# Altium schematic sheet 6-Wheel Sensors.SchDoc
size A4
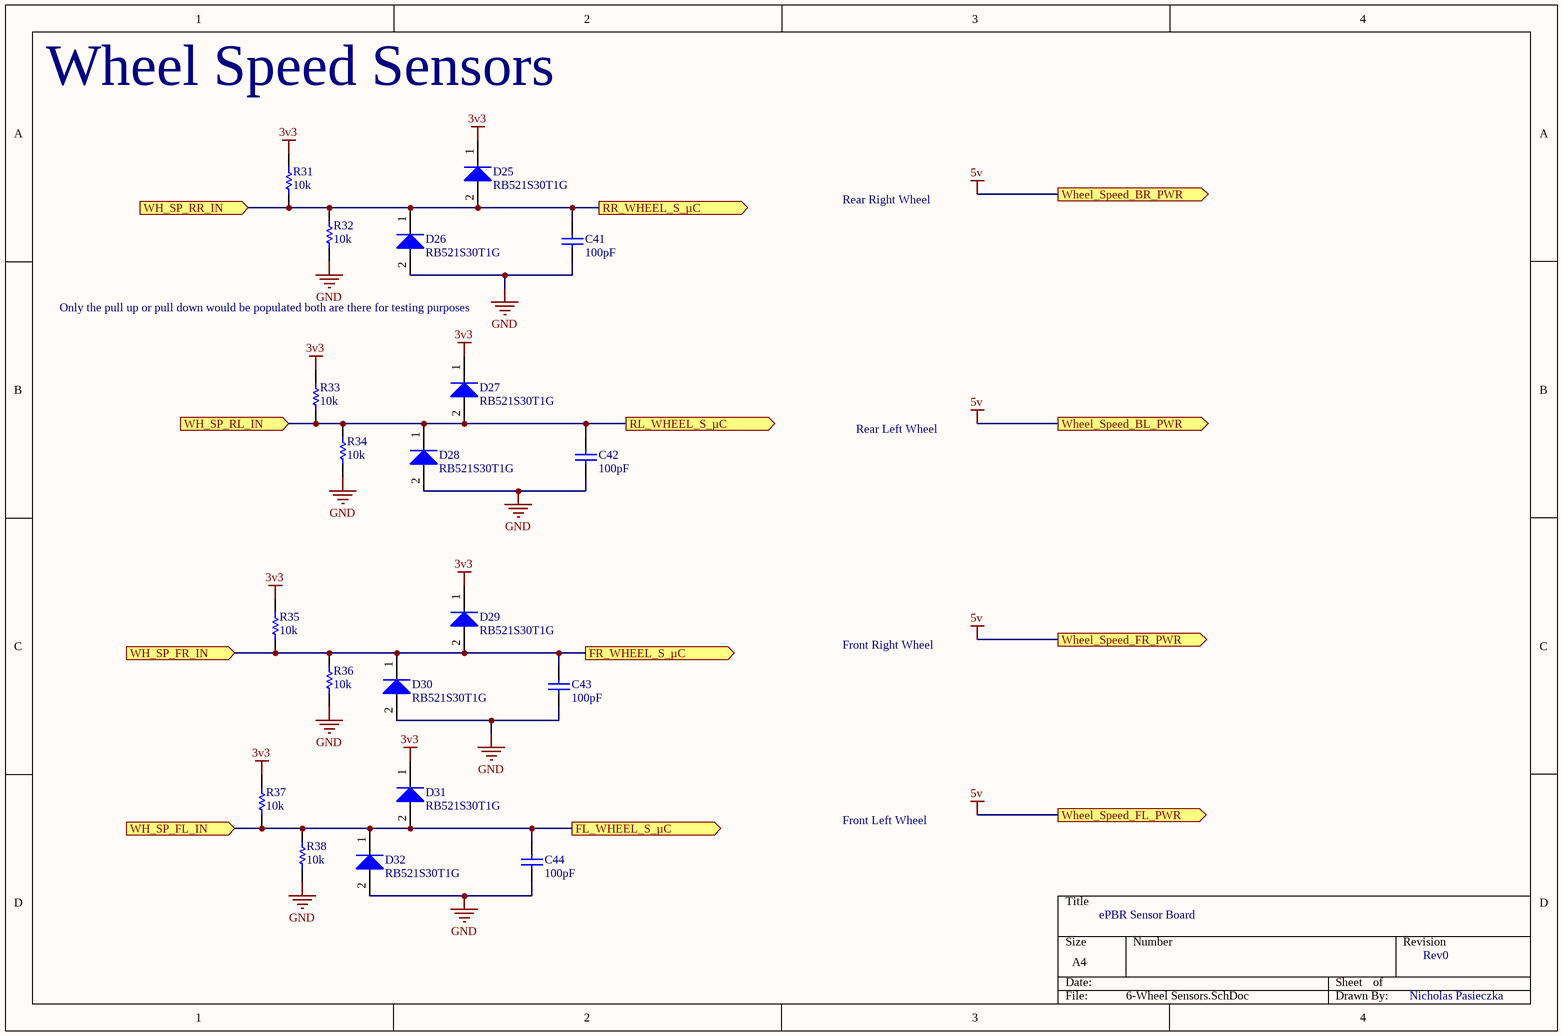
[diagram p0: 6-Wheel Sensors.SchDoc]

## Parts
C41  value 100pF  [1608[0603]]  (hidden comment: Cap)
C42  value 100pF  [1608[0603]]  (hidden comment: Cap)
C43  value 100pF  [1608[0603]]  (hidden comment: Cap)
C44  value 100pF  [1608[0603]]  (hidden comment: Cap)
D25  RB521S30T1G  [ONSC-SOD-523-2-502-01_V]
D26  RB521S30T1G  [ONSC-SOD-523-2-502-01_V]
D27  RB521S30T1G  [ONSC-SOD-523-2-502-01_V]
D28  RB521S30T1G  [ONSC-SOD-523-2-502-01_V]
D29  RB521S30T1G  [ONSC-SOD-523-2-502-01_V]
D30  RB521S30T1G  [ONSC-SOD-523-2-502-01_V]
D31  RB521S30T1G  [ONSC-SOD-523-2-502-01_V]
D32  RB521S30T1G  [ONSC-SOD-523-2-502-01_V]
R31  value 10k  [1608[0603]]  (hidden comment: Res1)
R32  value 10k  [1608[0603]]  (hidden comment: Res1)
R33  value 10k  [1608[0603]]  (hidden comment: Res1)
R34  value 10k  [1608[0603]]  (hidden comment: Res1)
R35  value 10k  [1608[0603]]  (hidden comment: Res1)
R36  value 10k  [1608[0603]]  (hidden comment: Res1)
R37  value 10k  [1608[0603]]  (hidden comment: Res1)
R38  value 10k  [1608[0603]]  (hidden comment: Res1)

## Ports
FL_WHEEL_S_µC (out), FR_WHEEL_S_µC (out), RL_WHEEL_S_µC (out), RR_WHEEL_S_µC (out), WH_SP_FL_IN (in), WH_SP_FR_IN (in), WH_SP_RL_IN (in), WH_SP_RR_IN (in), Wheel_Speed_BL_PWR (out), Wheel_Speed_BR_PWR (out), Wheel_Speed_FL_PWR (out), Wheel_Speed_FR_PWR (out)

## Nets
3v3: D25.1(K) D27.1(K) D29.1(K) D31.1(K) R31.2 R33.2 R35.2 R37.2
5v: port Wheel_Speed_BR_PWR, port Wheel_Speed_BL_PWR, port Wheel_Speed_FR_PWR, port Wheel_Speed_FL_PWR
GND: C41.1 C42.1 C43.1 C44.1 D26.2(A) D28.2(A) D30.2(A) D32.2(A) R32.1 R34.1 R36.1 R38.1
FL_WHEEL_S_µC: C44.2 D31.2(A) D32.1(K) R37.1 R38.2 ; port FL_WHEEL_S_µC, port WH_SP_FL_IN
FR_WHEEL_S_µC: C43.2 D29.2(A) D30.1(K) R35.1 R36.2 ; port FR_WHEEL_S_µC, port WH_SP_FR_IN
RL_WHEEL_S_µC: C42.2 D27.2(A) D28.1(K) R33.1 R34.2 ; port RL_WHEEL_S_µC, port WH_SP_RL_IN
RR_WHEEL_S_µC: C41.2 D25.2(A) D26.1(K) R31.1 R32.2 ; port RR_WHEEL_S_µC, port WH_SP_RR_IN

## Notes on the sheet
- Wheel Speed Sensors
- Rear Right Wheel
- Only the pull up or pull down would be populated both are there for testing purposes
- Rear Left Wheel
- Front Right Wheel
- Front Left Wheel
- ePBR Sensor Board
- Rev0
- Nicholas Pasieczka

## Library data of the parts
C41-C44 = Cap: Capacitor; Published: 8-Jun-2000; LatestRevisionDate: 17-Jul-2002; LatestRevisionNote: Re-released for DXP Platform.; PackageReference: RAD-0.3; Publisher: Altium Limited; PackageDescription: Radial Cap, Thru-Hole; 2 Leads; 0.3 in Pin Spacing
D25-D32 = CMP-1051-00018-1: Schottky Barrier Diode, 2-Pin SOD-523, Pb-Free, Tape and Reel; Manufacturer: On Semiconductor; Configuration: Single; IFSM Max (A): 1; Mounting Technology: Surface Mount; ComponentLink1Description: Manufacturer URL; PackageReference: SOD-523-2-502-01; RoHS: TRUE; ComponentLink3Description: Package Specification; ComponentLink2Description: Datasheet; PackageVersion: Rev. E, 09/2010; PartNumber: RB521S30T1G; ComponentLink3URL: http://www.onsemi.com/pub_link/Collateral/502-01.PDF; ComponentLink1URL: http://www.onsemi.com/; PackageDescription: 2-Pin SOD, Body 1.2 x 0.8 mm; DatasheetVersion: Rev. 8; ComponentLink2URL: http://www.onsemi.cn/pub_link/Collateral/RB521S30T1-D.PDF; Packing: Tape and Reel
R31-R38 = Res1: Resistor; Manufacturer: Yageo; Manufacturer Part Number: RC0603JR-0710KL; Tolerance: ±5%; Power (Watts): 0.1W, 1/10W; Temperature Coefficient: ±100ppm/°C; Supplier 1: Digi-Key; Supplier Part Number 1: 311-10KGRCT-ND; RoHS: RoHS Compliant; Category: Resistors; Stock 1: 2936292; Pricing 1: 1=0.16, 10=0.016, 25=0.0112, 50=0.0084, 100=0.0062, 250=0.0048, 500=0.00382, 1000=0.00281 (CAD); Packaging: Cut Tape (CT); Part Status: Active; Resistance (Ohms): 10k; Composition: Thick Film; Features: Moisture Resistant; Operating Temperature: -55°C ~ 155°C; Package / Case: 0603 (1608 Metric); Supplier Device Package: 0603; Size / Dimension: 0.063" L x 0.031" W (1.60mm x 0.80mm); Height - Seated (Max): 0.022" (0.55mm); Number of Terminations: 2; Failure Rate: -; ComponentLink1URL: http://www.yageo.com/NewPortal/yageodocoutput?fileName=/pdf/R-Chip/PYu-RC_Group_51_RoHS_L_4.pdf; ComponentLink1Description: http://www.yageo.com/NewPortal/yageodocoutput?fileName=/pdf/R-Chip/PYu-RC_Group_51_RoHS_L_4.pdf